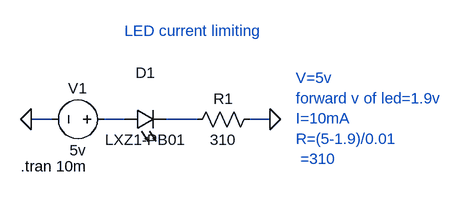
[diagram p0: schematic LED current limiting.asc]
LED current limiting.asc, the LTspice schematic file:
Version 4.1
SHEET 1 880 680
WIRE -48 112 -80 112
WIRE 64 112 32 112
WIRE 176 112 128 112
WIRE 288 112 256 112
FLAG -80 112 0
FLAG 288 112 0
SYMBOL voltage 48 112 R90
WINDOW 0 -32 56 VBottom 2
WINDOW 3 32 56 VTop 2
WINDOW 123 0 0 Left 0
WINDOW 39 0 0 Left 0
SYMATTR InstName V1
SYMATTR Value 5v
SYMBOL res 272 96 R90
WINDOW 0 0 56 VBottom 2
WINDOW 3 32 56 VTop 2
SYMATTR InstName R1
SYMATTR Value 310
SYMBOL LED 64 128 R270
WINDOW 0 72 32 VTop 2
WINDOW 3 0 32 VBottom 2
SYMATTR InstName D1
SYMATTR Value LXZ1-PB01
TEXT 328 48 Left 2 ;V=5v\nforward v of led=1.9v\nI=10mA\nR=(5-1.9)/0.01\n =310
TEXT -96 184 Left 2 !.tran 10m
TEXT 64 -24 Left 2 ;LED current limiting

The netlist it stands for:
* LED current limiting.asc
V1 N001 0 5v
R1 0 N002 310
D1 N001 N002 LXZ1-PB01
.model D D
.lib standard.dio
* V=5v
* forward v of led=1.9v
* I=10mA
* R=(5-1.9)/0.01
*  =310
.tran 10m
* LED current limiting
.backanno
.end